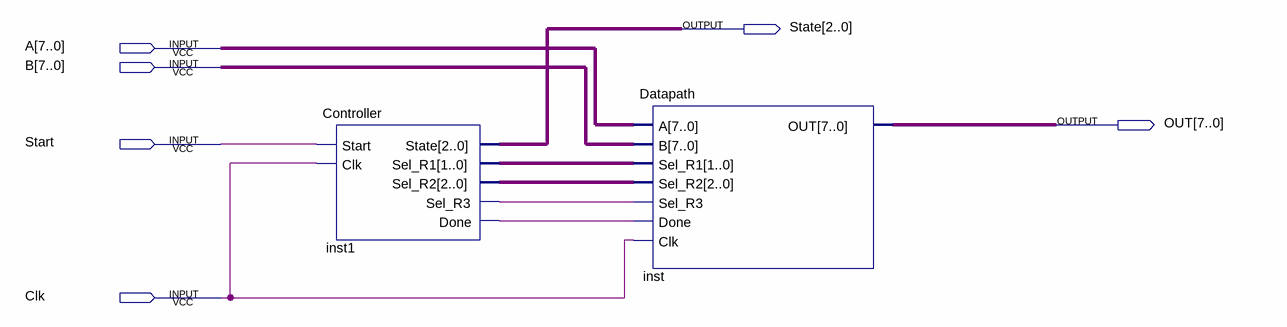
[diagram p0: schematic sheet]
// Quartus schematic Square-root_approximation.bdf as structural Verilog: 2 symbols, 6 pins
module \Square-root_approximation  (
  input  [7:0] A,
  input  [7:0] B,
  input  Start,
  input  Clk,
  output [2:0] State,
  output [7:0] OUT
);

  wire inst1_done, inst1_sel_r3;
  wire [1:0] inst1_sel_r1;
  wire [2:0] inst1_sel_r2;

  Controller inst1 (
    .Start(Start), .Clk(Clk), .State(State), .Sel_R1(inst1_sel_r1), .Sel_R2(inst1_sel_r2),
    .Sel_R3(inst1_sel_r3), .Done(inst1_done));
  Datapath inst (
    .A(A), .B(B), .Sel_R1(inst1_sel_r1), .Sel_R2(inst1_sel_r2), .Sel_R3(inst1_sel_r3), .Done(inst1_done),
    .Clk(Clk), .OUT(OUT));
endmodule
